# EasyEDA Pro project ProPrj_ant_switch_2026-03-30.epro

# Schematic Schematic1
Assembly Variant: Basic; Board Name: Board1; Create Date: 2026-03-23; Page Name: P1; Project Name: ant_switch; Schematic Name: Schematic1; Update Date: 2026-03-23; BladeWidth: 10; Company: 嘉立创EDA; Page Size: A4; RegionStart: 1; ShowBorder: 1; TitleBlock: 0; TitleBlockPosition: 3; Version: V1.0; XRegionCount: 6; YRegionCount: 4
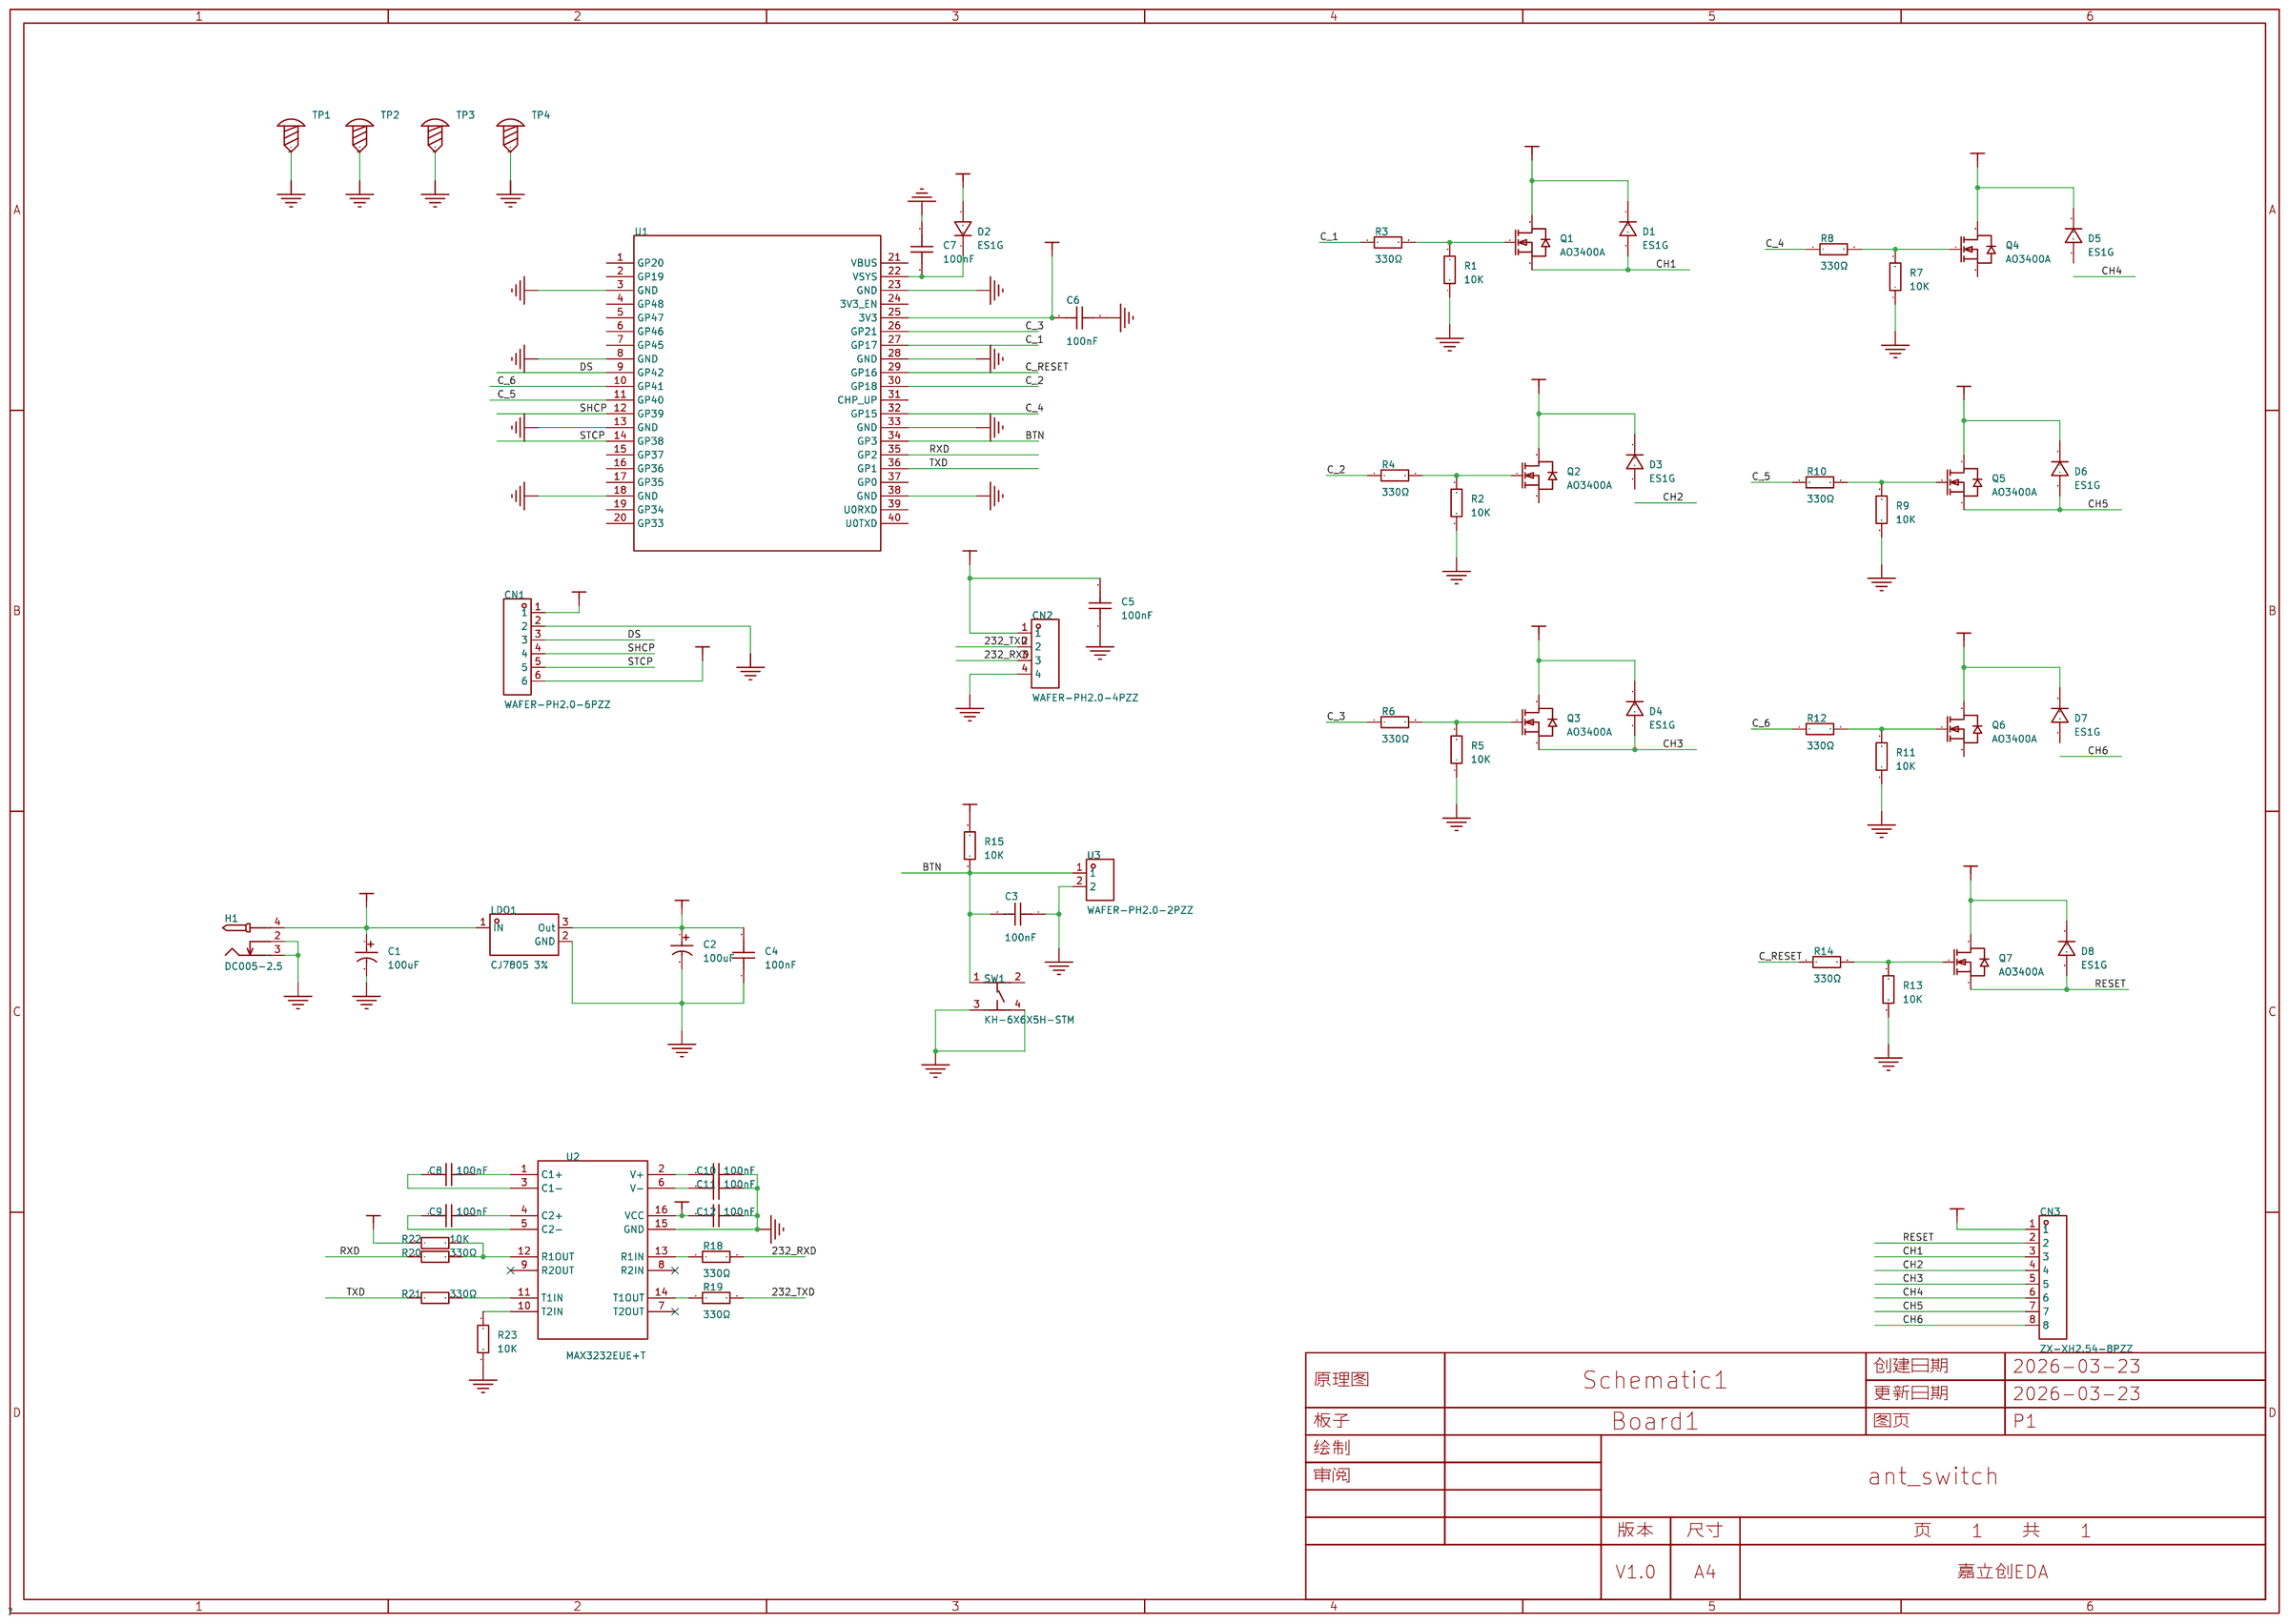
[diagram p0: schematic sheet]

## Parts
C1  100uF  [CAP-TH_BD6.3-P2.50-D1.0-FD]
C2  100uF  [CAP-TH_BD6.3-P2.50-D1.0-FD]
C3  100nF  [C0603]
C4  100nF  [C0603]
C5  100nF  [C0603]
C6  100nF  [C0603]
C7  100nF  [C0603]
C8  100nF  [C0603]
C9  100nF  [C0603]
C10  100nF  [C0603]
C11  100nF  [C0603]
C12  100nF  [C0603]
CN1  WAFER-PH2.0-6PZZ  [CONN-TH_6P-P2.00_PH2.0-6P]
CN2  WAFER-PH2.0-4PZZ  [CONN-TH_4P-P2.00_FWF20001-S04S22W5B]
CN3  ZX-XH2.54-8PZZ  [CONN-TH_8P-P2.50-XH2.54-8P]
D1  ES1G  [SMA_L4.4-W2.8-LS5.4-RD]
D2  ES1G  [SMA_L4.4-W2.8-LS5.4-RD]
D3  ES1G  [SMA_L4.4-W2.8-LS5.4-RD]
D4  ES1G  [SMA_L4.4-W2.8-LS5.4-RD]
D5  ES1G  [SMA_L4.4-W2.8-LS5.4-RD]
D6  ES1G  [SMA_L4.4-W2.8-LS5.4-RD]
D7  ES1G  [SMA_L4.4-W2.8-LS5.4-RD]
D8  ES1G  [SMA_L4.4-W2.8-LS5.4-RD]
H1  DC005-2.5  [DC-IN-TH_DC005-2.5MM]
LDO1  CJ7805 3%  [TO-252-2_L6.6-W6.1-P4.58-LS10.1-BR-CW]
Q1  AO3400A  [SOT-23-3_L2.9-W1.3-P1.90-LS2.4-BR]
Q2  AO3400A  [SOT-23-3_L2.9-W1.3-P1.90-LS2.4-BR]
Q3  AO3400A  [SOT-23-3_L2.9-W1.3-P1.90-LS2.4-BR]
Q4  AO3400A  [SOT-23-3_L2.9-W1.3-P1.90-LS2.4-BR]
Q5  AO3400A  [SOT-23-3_L2.9-W1.3-P1.90-LS2.4-BR]
Q6  AO3400A  [SOT-23-3_L2.9-W1.3-P1.90-LS2.4-BR]
Q7  AO3400A  [SOT-23-3_L2.9-W1.3-P1.90-LS2.4-BR]
R1  10K  [R0603]
R2  10K  [R0603]
R3  330Ω  [R0603]
R4  330Ω  [R0603]
R5  10K  [R0603]
R6  330Ω  [R0603]
R7  10K  [R0603]
R8  330Ω  [R0603]
R9  10K  [R0603]
R10  330Ω  [R0603]
R11  10K  [R0603]
R12  330Ω  [R0603]
R13  10K  [R0603]
R14  330Ω  [R0603]
R15  10K  [R0603]
R18  330Ω  [R0603]
R19  330Ω  [R0603]
R20  330Ω  [R0603]
R21  330Ω  [R0603]
R22  10K  [R0603]
R23  10K  [R0603]
SW1  KH-6X6X5H-STM  [SW-SMD_4P-L6.0-W6.0-P4.50-LS9.0_H5.0]
TP1  -  [M3螺丝孔]
TP2  -  [M3螺丝孔]
TP3  -  [M3螺丝孔]
TP4  -  [M3螺丝孔]
U1  -  [esp32-s3]
U2  MAX3232EUE+T  [TSSOP-16_L5.0-W4.4-P0.65-LS6.4-BL]
U3  WAFER-PH2.0-2PZZ  [CONN-TH_2P-P2.00_HC-PH-2A-M]

## Library data of the parts
C1 C2 = ERS1EM101E11OT: 容值:100uF;精度:±20%;额定电压:25V;; LCSC Part Name: 100uF ±20% 25V; Supplier Part: C112509; Manufacturer: AISHI(艾华集团); Supplier Footprint: 插件,D6.3xL11mm; JLCPCB Part Class: Extended Part; Datasheet: https://item.szlcsc.com/datasheet/ERS1EM101E11OT/113742.html; Supplier: LCSC; Tolerance: ±20%; Voltage Rating: 25V; Pin Spacing: 2.5mm; Diameter: 6.3mm; Height - Seated (Max): 11mm; Lifetime: 5000hrs@105℃
C3-C12 = CC0603KRX7R9BB104: 容值:100nF;精度:±10%;额定电压:50V;温度系数:X7R;; LCSC Part Name: 100nF ±10% 50V; Supplier Part: C14663; Manufacturer: YAGEO(国巨); Supplier Footprint: 0603; JLCPCB Part Class: Basic Part; Datasheet: https://item.szlcsc.com/datasheet/CC0603KRX7R9BB104/15331.html; Supplier: LCSC; Tolerance: ±10%; Voltage Rating: 50V; Temperature Coefficient: X7R
CN1 = WAFER-PH2.0-6PZZ: 插针结构:1x6P;间距:2mm;安装方式:直插;参考系列:PH;总PIN数:6P;排数:1;每排PIN数:6;行距:-;额定电流:2A;触头材质:黄铜;触头镀层:锡;工作温度:-25℃~+85℃;; LCSC Part Name: 1x6P 间距:2mm 直插 系列:PH; Supplier Part: C5359603; Manufacturer: XUNPU(讯普); Supplier Footprint: 插件,P=2mm; JLCPCB Part Class: Extended Part; Datasheet: https://atta.szlcsc.com/upload/public/pdf/source/20241108/09B74E94153224768C62B7F095CB8C18.pdf; Supplier: LCSC; Pins Structure: 1x6P; Pitch: 2mm; Mounting Type: 直插; Reference Series: PH; Number of Pins: 6P; Number of Rows: 1; Number of PINs Per Row: 6; Current Rating: 2A; Contact Material: 黄铜; Contact Plating: 锡; Operating Temperature: -25℃~+85℃; Voltage Rating: 250V; Plastic Material: PA66; Flame Retardant Rating: UL94V-0; Color: 白色; Z-Height of the Board: 6.05mm; X-Length of Bottom Edge on Board (Spacing Line): 14mm; Y-Width of Bottom Edge on Board: 4.7mm
CN2 = WAFER-PH2.0-4PZZ: 插针结构:1x4P;间距:2mm;安装方式:直插;参考系列:PH;总PIN数:4P;排数:1;每排PIN数:4;行距:-;额定电流:2A;触头材质:黄铜;触头镀层:锡;工作温度:-25℃~+85℃;; LCSC Part Name: 1x4P 间距:2mm 直插 系列:PH; Supplier Part: C5359601; Manufacturer: XUNPU(讯普); Supplier Footprint: 插件,P=2mm; JLCPCB Part Class: Extended Part; Datasheet: https://item.szlcsc.com/datasheet/WAFER-PH2.0-4PZZ/6173837.html; Supplier: LCSC; Pins Structure: 1x4P; Pitch: 2mm; Mounting Type: 直插; Reference Series: PH; Number of Pins: 4P; Number of Rows: 1; Number of PINs Per Row: 4; Current Rating: 2A; Contact Material: 黄铜; Contact Plating: 锡; Operating Temperature: -25℃~+85℃; Voltage Rating: 250V; Plastic Material: PA66; Flame Retardant Rating: UL94V-0; Color: 白色; Z-Height of the Board: 6.05mm; X-Length of Bottom Edge on Board (Spacing Line): 10mm; Y-Width of Bottom Edge on Board: 4.7mm
CN3 = ZX-XH2.54-8PZZ: 插针结构:1x8P;间距:2.5mm;安装方式:直插;参考系列:XH;总PIN数:8P;排数:1;每排PIN数:8;行距:-;额定电流:3A;触头材质:黄铜;触头镀层:锡;工作温度:-25℃~+85℃;; LCSC Part Name: 1x8P 间距:2.5mm 直插 系列:XH; Supplier Part: C7429638; Manufacturer: Megastar(兆星); Supplier Footprint: 插件,P=2.5mm; JLCPCB Part Class: Extended Part; Datasheet: https://item.szlcsc.com/datasheet/ZX-XH2.54-8PZZ/8427555.html; Supplier: LCSC; Pins Structure: 1x8P; Pitch: 2.5mm; Mounting Type: 直插; Reference Series: XH; Number of Pins: 8P; Number of Rows: 1; Number of PINs Per Row: 8; Current Rating: 3A; Contact Material: 黄铜; Contact Plating: 锡; Operating Temperature: -25℃~+85℃; Voltage Rating: 250V; Plastic Material: PA66; Flame Retardant Rating: UL94V-0; Color: 白色; Z-Height of the Board: 7mm; X-Length of Bottom Edge on Board (Spacing Line): 22.5mm; Y-Width of Bottom Edge on Board: 5.9mm
D1-D8 = ES1G_C124478: 二极管配置:-;正向压降(Vf):1.3V@1A;直流反向耐压(Vr):400V;整流电流:1A;反向恢复时间(Trr):35ns;; LCSC Part Name: 耐压:400V 电流:1A 反向恢复时间：35ns; Supplier Part: C124478; Manufacturer: onsemi(安森美); Supplier Footprint: SMA(DO-214AC); JLCPCB Part Class: Extended Part; Datasheet: https://item.szlcsc.com/datasheet/ES1G/125753.html; Supplier: LCSC; Voltage - Forward(Vf@If): 1.3V@1A; Voltage - DC Reverse(Vr): 400V; Current - Rectified: 1A; Reverse Leakage Current (Ir): 5uA@400V; Reverse Recovery Time (trr): 35ns; Pd - Power Dissipation: 1.47W; Non-Repetitive Peak Forward Surge Current: 30A
H1 = DC005-2.5: 连接器类型:DC电源插座;安装方式:弯插;触点内径:2.5mm;触点外径:6.3mm;额定电流:500mA;额定电压:12V;工作温度:-30℃~+70℃;; LCSC Part Name: DC005-2.5黑(铁); Supplier Part: C7507454; Manufacturer: SHOU HAN(首韩); Supplier Footprint: 插件; JLCPCB Part Class: Extended Part; Datasheet: https://item.szlcsc.com/datasheet/DC005-2.5/8598476.html; Supplier: LCSC; Connector Type: DC电源插座; Mounting Type: 弯插; Inside Contact Diameter: 2.5mm; Outside Contact Diameter: 6.3mm; Current Rating: 500mA; Voltage Rating (Max): 12V; Operating Temperature: -30℃~+70℃
LDO1 = CJ7805 3%: 输出类型:固定;工作电压:35V;输出电压:5V;输出电流:1.5A;电源纹波抑制比(PSRR):73dB@(120Hz);输出极性:正极;; LCSC Part Name: 5V 1.5A 35V; Supplier Part: C21706; Manufacturer: CJ(江苏长电/长晶); Supplier Footprint: TO-252-2(DPAK); JLCPCB Part Class: Extended Part; Datasheet: https://item.szlcsc.com/datasheet/CJ7805%25203%2525/22427.html; Supplier: LCSC; Output Type: 固定; Voltage - Supply: 35V; Output Voltage: 5V; Output Current: 1.5A; Power Supply Rejection Ratio (PSRR): 73dB@(120Hz); Voltage Dropout: 2V@(1A); standby current: 5mA; Operating Temperature: -25℃~+125℃@(Tj); Output Configuration: 正极; Number of Outputs: 1
Q1-Q7 = AO3400A_C347475: 数量:1个N沟道;漏源电压(Vdss):30V;连续漏极电流(Id):5.8A;导通电阻(RDS(on)):17mΩ@10V;耗散功率(Pd):1.4W;阈值电压(Vgs(th)):1.1V@250uA;; LCSC Part Name: 1个N沟道 耐压:30V 电流:5.8A; Supplier Part: C347475; Manufacturer: UMW(友台半导体); Supplier Footprint: SOT-23; JLCPCB Part Class: Extended Part; Datasheet: https://item.szlcsc.com/datasheet/AO3400A/324135.html; Supplier: LCSC; Number: 1个N沟道; Drain to Source Voltage: 30V; Current - Continuous Drain(Id): 5.8A; RDS(on): 17mΩ@10V; Pd - Power Dissipation: 1.4W; Gate Threshold Voltage (Vgs(th)): 1.1V@250uA; Gate Charge(Qg): 9.7nC@4.5V; Input Capacitance(Ciss): 823pF; Reverse Transfer Capacitance (Crss@Vds): 77pF; Operating Temperature: -55℃~+150℃; Output Capacitance(Coss): 99pF
R1 R2 R5 R7 R9 R11 R13 R15 R22 R23 = Res_0603: Supplier Footprint: 0603
R3 R4 R6 R8 R10 R12 R14 R18-R21 = 0603WAF3300T5E: 电阻类型:厚膜电阻;阻值:330Ω;精度:±1%;功率:100mW;最大工作电压:75V;温度系数:±100ppm/℃;; LCSC Part Name: 330Ω ±1% 100mW 厚膜电阻; Supplier Part: C23138; Manufacturer: UNI-ROYAL(厚声); Supplier Footprint: 0603; JLCPCB Part Class: Basic Part; Datasheet: https://atta.szlcsc.com/upload/public/pdf/source/20200306/C422600_1E6D84923E4A46A82E41ADD87F860B5C.pdf; Supplier: LCSC; Type: 厚膜电阻; Tolerance: ±1%; Power(Watts): 100mW; Overload Voltage (Max): 75V; Temperature Coefficient: ±100ppm/℃; Operating Temperature Range: -55℃~+155℃
SW1 = KH-6X6X5H-STM: 电路结构:单刀单掷;按钮形状:圆形按钮;安装方式:立贴;开关长度:6mm;开关宽度:6mm;开关高度:5mm;带支架:不带支架;触点电流:50mA;额定电压:12V;工作寿命:8万次;; LCSC Part Name: 6*6*5mm 立贴 轻触开关; Supplier Part: C2837531; Manufacturer: kinghelm(金航标); Supplier Footprint: SMD-4P,6x6mm; JLCPCB Part Class: Extended Part; Datasheet: https://item.szlcsc.com/datasheet/KH-6X6X5H-STM/3009601.html; Supplier: LCSC; Circuit: 单刀单掷; Actuator Style: 圆形按钮; Mounting Type: 立贴; Length: 6mm; Width: 6mm; Switch Height: 5mm; with Bracket: 不带支架; Contact Current: 50mA; Voltage Rating: 12V; Actuator/Cap Color: 黑色; Termination Style: 鸥翼型; Life: 8万次
TP1-TP4 = M3螺丝孔: Supplier Footprint: 插件
U1 = esp32-s3-eth-main: esp32eth coreboard
U2 = MAX3232EUE+T: 类型:收发器;数据速率:250Kbps;; LCSC Part Name: 3.0V至5.5V低功耗高达1Mbps真RS-232收发器使用四个0.1uF外部电容; Supplier Part: C19767; Manufacturer: ADI(亚德诺)/MAXIM(美信); Supplier Footprint: TSSOP-16; JLCPCB Part Class: Extended Part; Datasheet: https://item.szlcsc.com/datasheet/MAX3232EUE%252BT/20476.html; Supplier: LCSC; Type: 收发器; Number of Drivers: 2; Number of Receivers: 2; Data Rate: 250Kbps; Voltage - Supply: 3V~5.5V; ESD Protect: ±15kV; charge pump: 有; Operating Temperature: -40℃~+85℃; Supply Current (Iq): 1mA
U3 = WAFER-PH2.0-2PZZ: 插针结构:1x2P;间距:2mm;安装方式:直插;参考系列:PH;总PIN数:2P;排数:1;每排PIN数:2;行距:-;额定电流:2A;触头材质:黄铜;触头镀层:锡;工作温度:-25℃~+85℃;; LCSC Part Name: 1x2P 间距:2mm 直插 系列:PH; Supplier Part: C5359599; Manufacturer: XUNPU(讯普); Supplier Footprint: 插件,P=2mm; JLCPCB Part Class: Extended Part; Datasheet: https://atta.szlcsc.com/upload/public/pdf/source/20241108/09B74E94153224768C62B7F095CB8C18.pdf; Supplier: LCSC; Pins Structure: 1x2P; Pitch: 2mm; Mounting Type: 直插; Reference Series: PH; Number of Pins: 2P; Number of Rows: 1; Number of PINs Per Row: 2; Current Rating: 2A; Contact Material: 黄铜; Contact Plating: 锡; Operating Temperature: -25℃~+85℃; Voltage Rating: 250V; Plastic Material: PA66; Flame Retardant Rating: UL94V-0; Color: 白色; Z-Height of the Board: 6.05mm; X-Length of Bottom Edge on Board (Spacing Line): 6mm; Y-Width of Bottom Edge on Board: 4.7mm

## Nets
3V3: C6.2 R15.2 U1.25(3V3)
12VDC: C1.1 CN1.1 CN3.1 D1.1 D3.1 D4.1 D5.1 D6.1 D7.1 D8.1 H1.4 LDO1.1(IN) Q1.3(D) Q2.3(D) Q3.3(D) Q4.3(D) Q5.3(D) Q6.3(D) Q7.3(D)
+5V: C2.1 C4.2 C5.2 C12.2 CN1.6 CN2.1 D2.2 LDO1.3(Out) R22.2 U2.16(VCC)
GND: C1.2 C2.2 C3.1 C4.1 C5.1 C6.1 C7.1 C10.1 C11.1 C12.1 CN1.2 CN2.4 H1.2 H1.3 LDO1.2(GND) R1.1 R2.1 R5.1 R7.1 R9.1 R11.1 R13.1 R23.1 SW1.3 SW1.4 TP1.1 TP2.1 TP3.1 TP4.1 U1.3(GND) U1.8(GND) U1.13(GND) U1.18(GND) U1.23(GND) U1.28(GND) U1.33(GND) U1.38(GND) U2.15(GND) U3.2
232_RXD: CN2.3 R18.2
232_TXD: CN2.2 R19.2
BTN: C3.2 R15.1 SW1.1 U1.34(GP3) U3.1
C_1: R3.1 U1.27(GP17)
C_2: R4.1 U1.30(GP18)
C_3: R6.1 U1.26(GP21)
C_4: R8.1 U1.32(GP15)
C_5: R10.1 U1.11(GP40)
C_6: R12.1 U1.10(GP41)
C_RESET: R14.1 U1.29(GP16)
CH1: CN3.3 D1.2 Q1.2(S)
CH2: CN3.4 D3.2 Q2.2(S)
CH3: CN3.5 D4.2 Q3.2(S)
CH4: CN3.6 D5.2 Q4.2(S)
CH5: CN3.7 D6.2 Q5.2(S)
CH6: CN3.8 D7.2 Q6.2(S)
DS: CN1.3 U1.9(GP42)
RESET: CN3.2 D8.2 Q7.2(S)
RXD: R20.1 U1.35(GP2)
SHCP: CN1.4 U1.12(GP39)
STCP: CN1.5 U1.14(GP38)
TXD: R21.1 U1.36(GP1)
$1N44: C7.2 D2.1 U1.22(VSYS)
$1N47: Q1.1(G) R1.2 R3.2
$1N54: Q2.1(G) R2.2 R4.2
$1N59: Q3.1(G) R5.2 R6.2
$1N79: Q4.1(G) R7.2 R8.2
$1N84: Q5.1(G) R9.2 R10.2
$1N89: Q6.1(G) R11.2 R12.2
$1N94: Q7.1(G) R13.2 R14.2
$1N131: C8.1 U2.1(C1+)
$1N132: C8.2 U2.3(C1-)
$1N133: C9.2 U2.5(C2-)
$1N134: C9.1 U2.4(C2+)
$1N135: C10.2 U2.2(V+)
$1N136: C11.2 U2.6(V-)
$1N142: R18.1 U2.13(R1IN)
$1N144: R19.1 U2.14(T1OUT)
$1N145: R20.2 R22.1 U2.12(R1OUT)
$1N147: R21.2 U2.11(T1IN)
$1N149: R23.2 U2.10(T2IN)

Not connected (* = marked no-connect by the designer): SW1 2; U1 1(GP20) 2(GP19) 4(GP48) 5(GP47) 6(GP46) 7(GP45) 15(GP37) 16(GP36) 17(GP35) 19(GP34) 20(GP33) 21(VBUS) 24(3V3_EN) 31(CHP_UP) 37(GP0) 39(U0RXD) 40(U0TXD); U2 7(T2OUT)* 8(R2IN)* 9(R2OUT)*

# Board PCB1
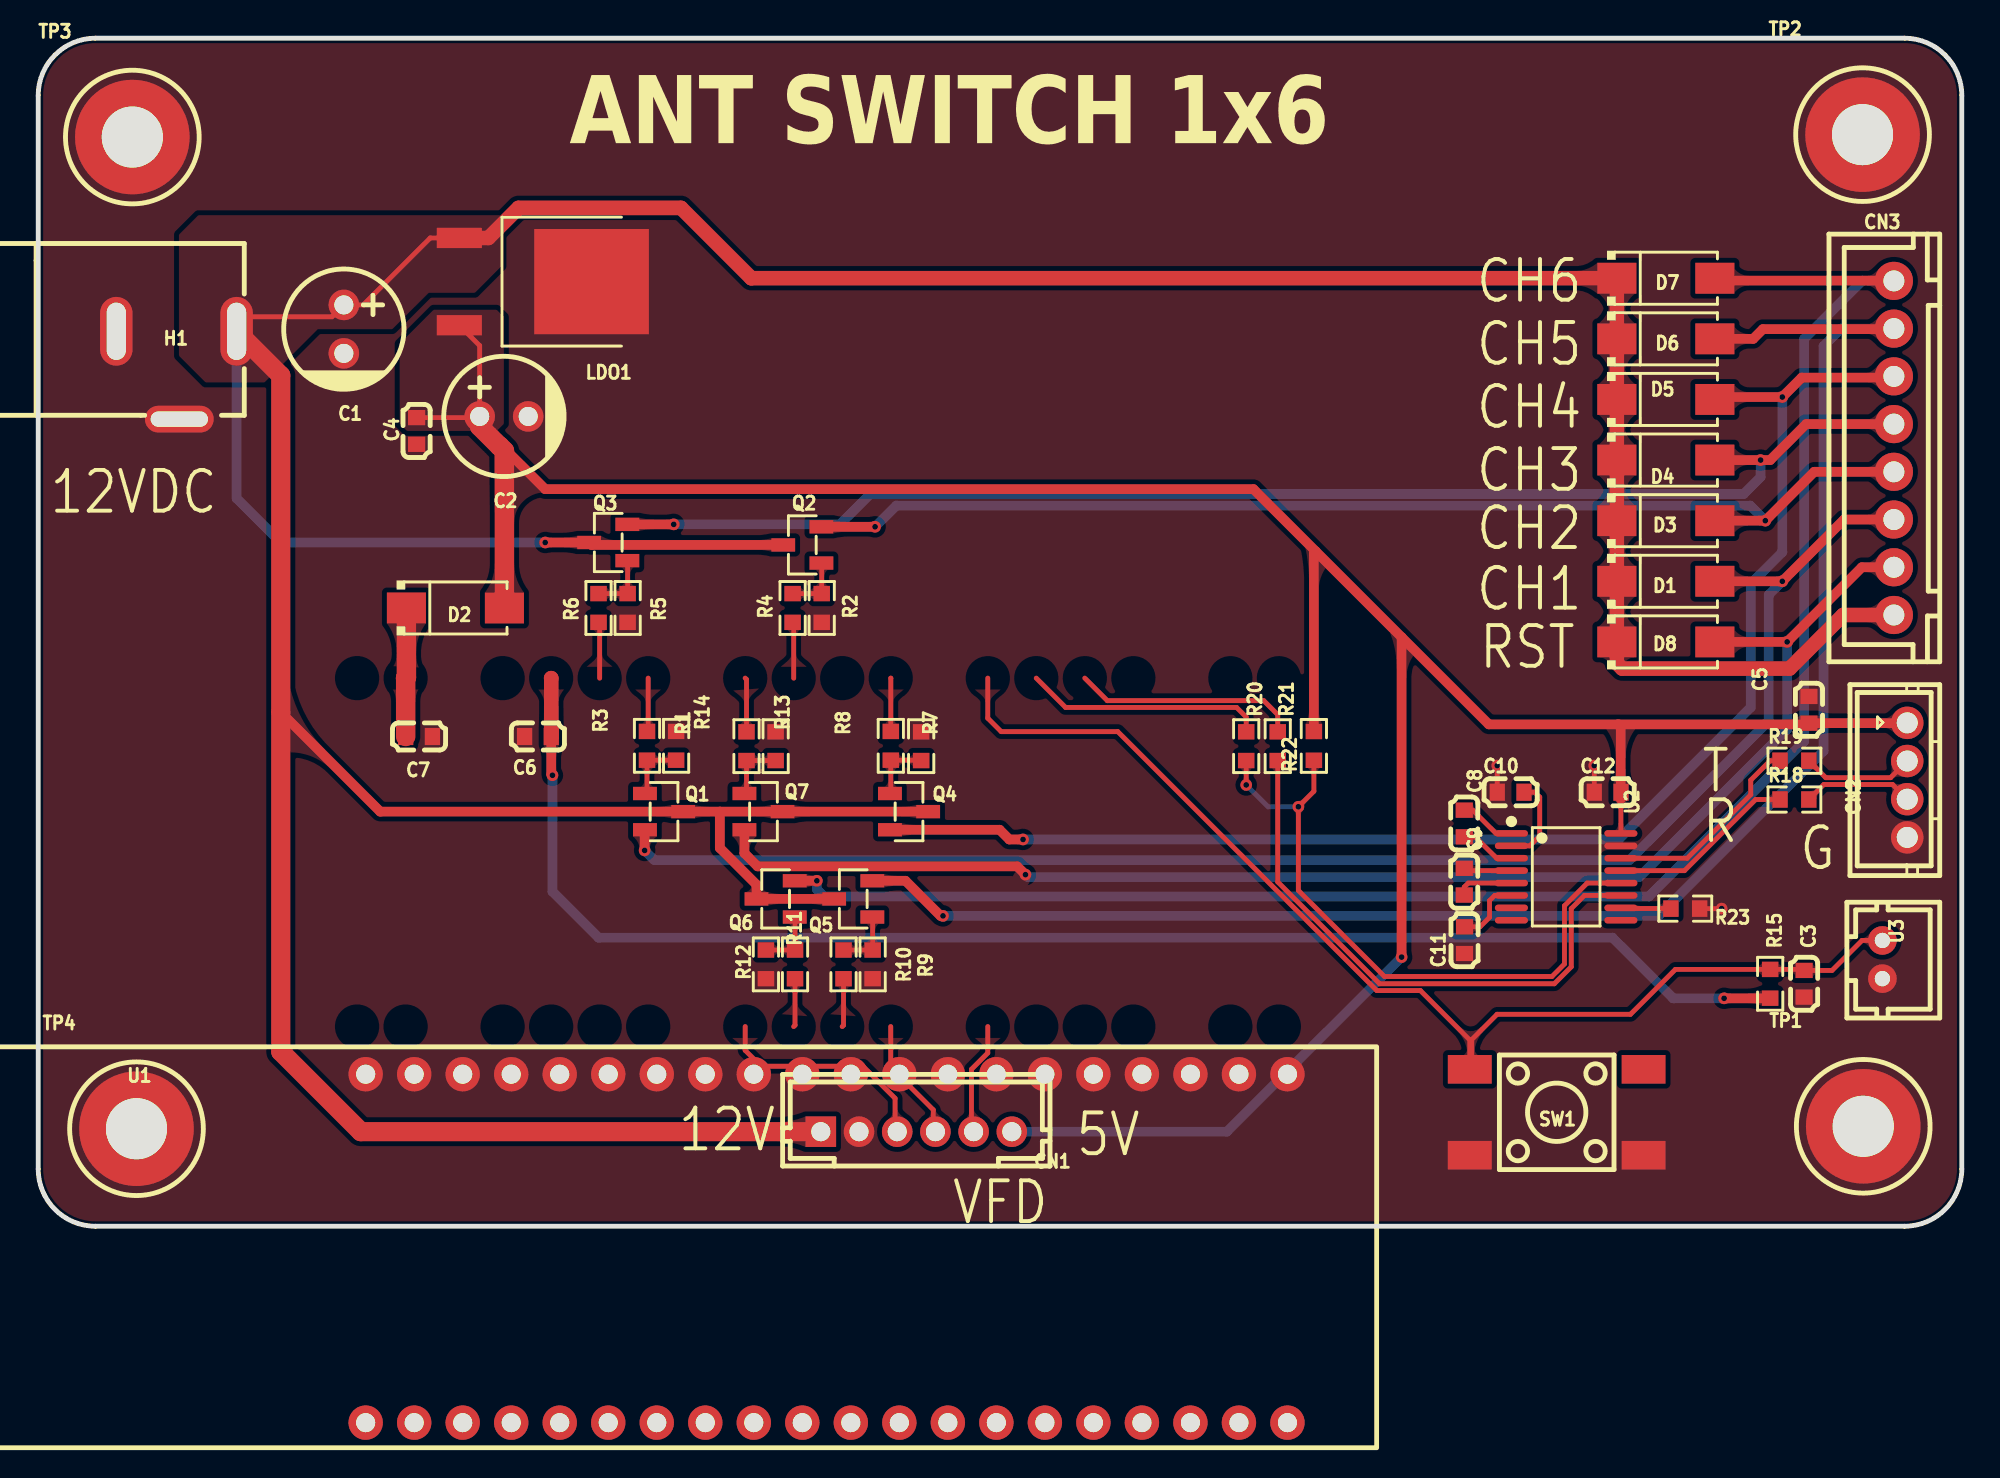
[diagram p1: board, top side]
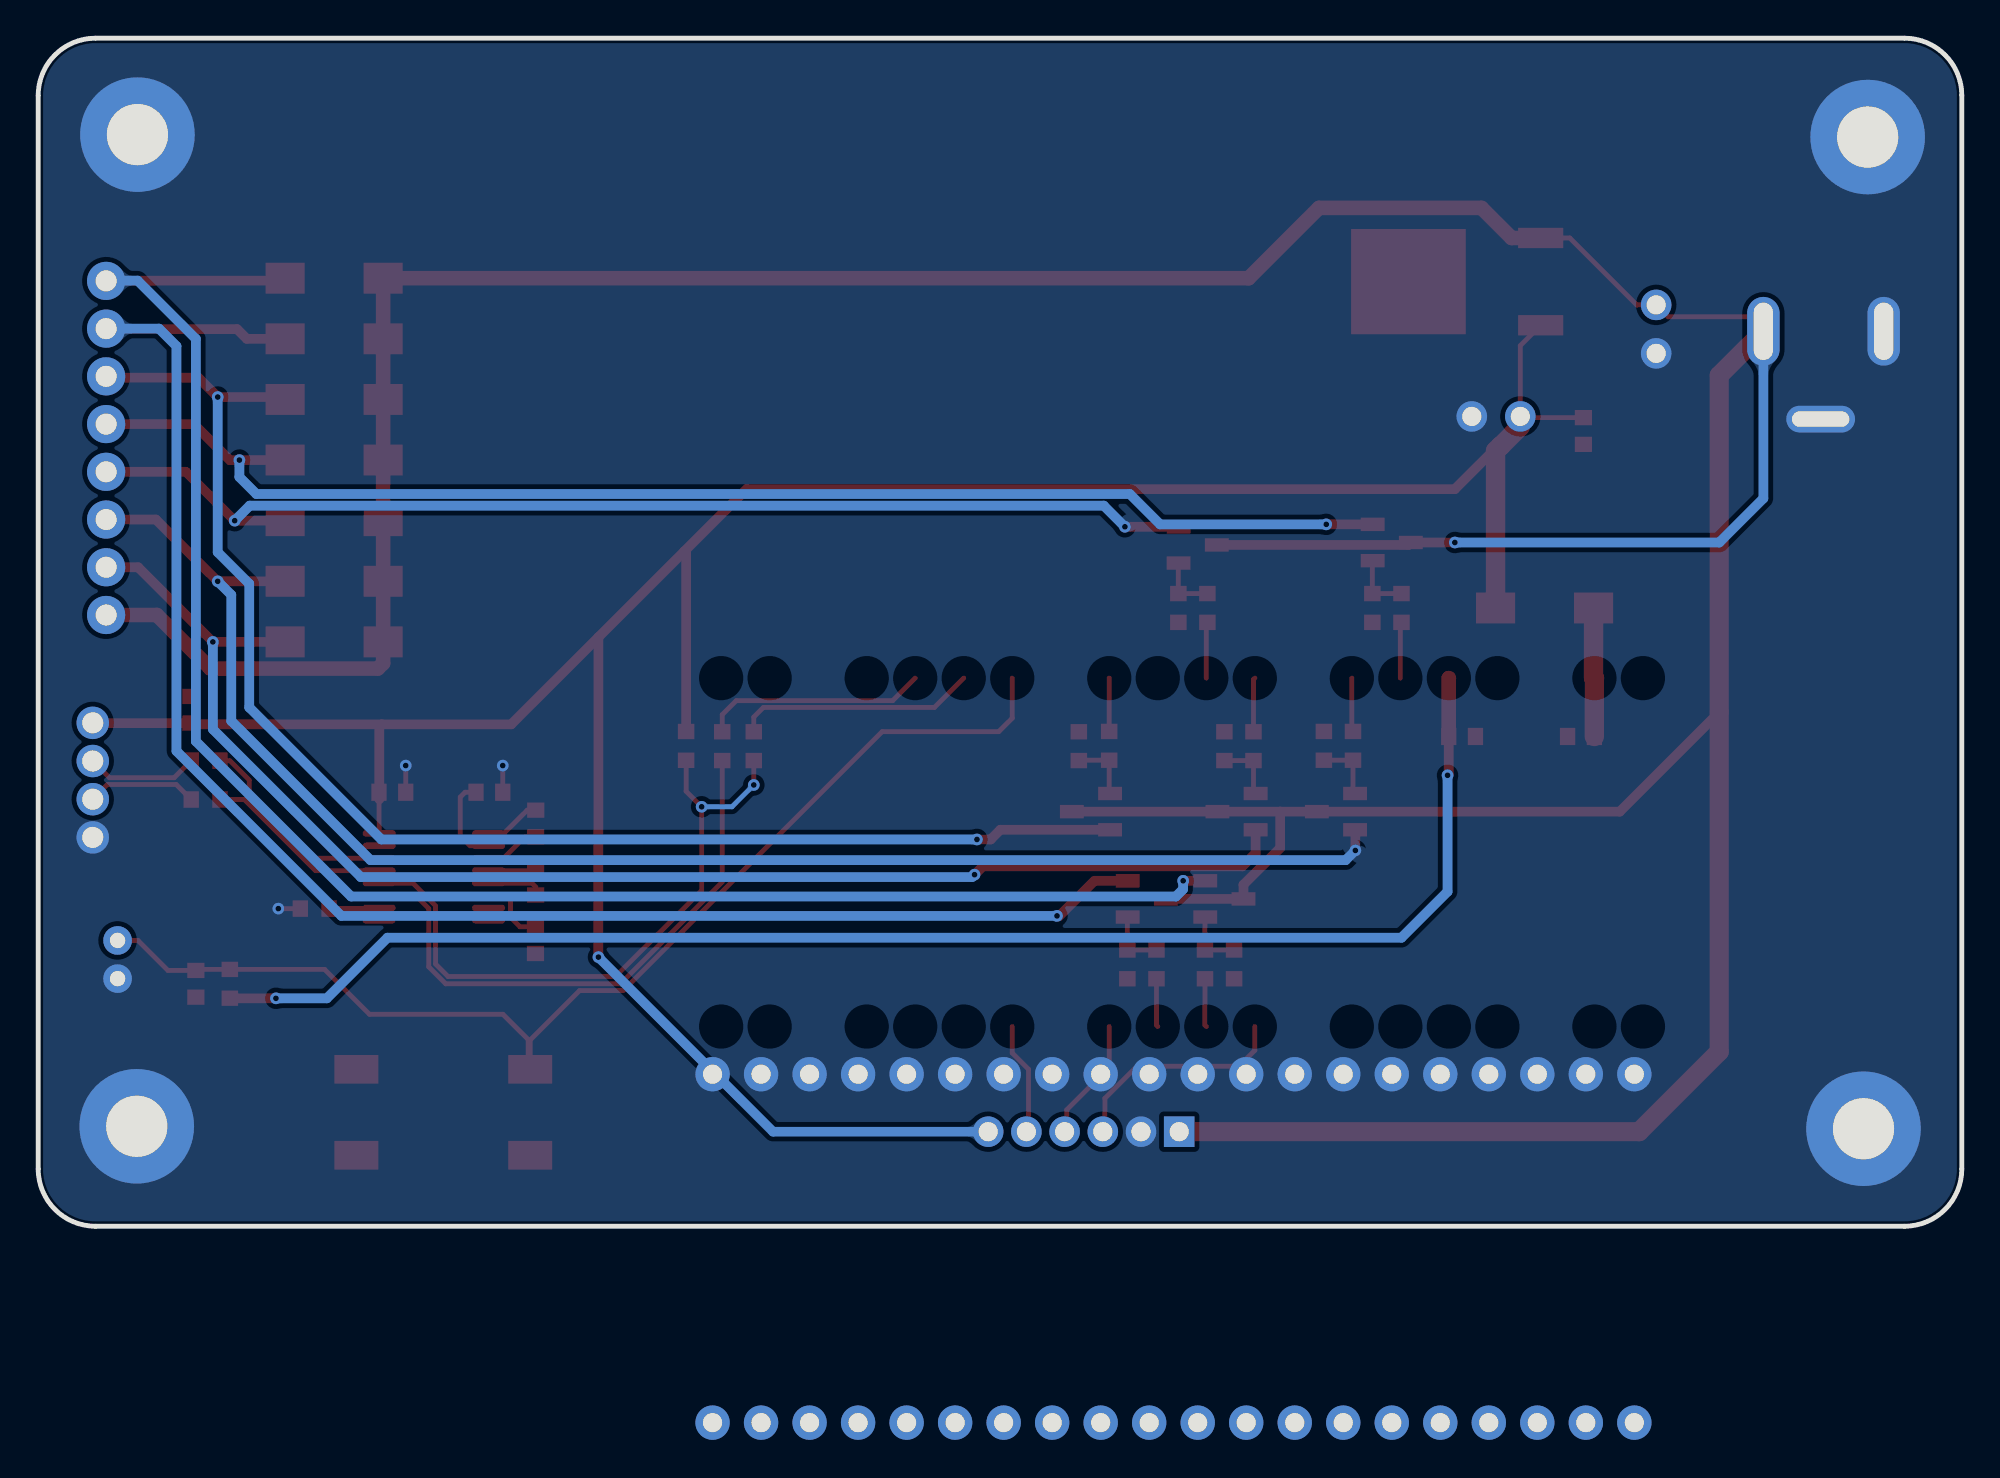
[diagram p2: board, bottom side, seen from below]

Outline 100.71 x 62.23 mm; copper layers: Top Layer, Bottom Layer. Coordinates in mm from the lower left corner of the outline.
Outline path: 0,59.23 0,3 arc(0.88,0.88) 3,0 97.71,0 arc(99.83,0.88) 100.71,3 100.71,59.23 arc(99.83,61.35) 97.71,62.23 3,62.23 arc(0.88,61.35) 0,59.23
Stack: Top Layer 0.035mm / Dielectric1 1.51mm FR4 er 4.5 / Bottom Layer 0.035mm

## Design rules (mm)
spacing copperThickness1oz (default): track to track 0.102, other pairs 0.152 to 0.3
spacing copperThickness2oz: track to track 0.203, other pairs 0.152 to 0.3
track width copperThickness1oz (default): min 0.127, default 0.254, max 2.54
track width copperThickness2oz: min 0.203, default 0.254, max 2.54
differential pair differentialPair (default): width min 0.127, default 0.254, max 2.54; gap min 0.152, default 0.152
net 12VDC uses copperRegion_copperThickness1oz
net +5V uses copperRegion_copperThickness1oz
pour e202 uses copperRegion_default, default
net GND uses copperRegion_copperThickness1oz
pour e200 uses copperRegion_copperThickness1oz, copperThickness1oz

## Placement (name value [footprint] x y rotation side)
C1  100uF  [CAP-TH_BD6.3-P2.50-D1.0-FD]  16 46.99 270 top
C2  100uF  [CAP-TH_BD6.3-P2.50-D1.0-FD]  24.38 42.42 0 top
C3  100nF  [C0603]  92.46 12.7 90 top
C4  100nF  [C0603]  19.81 41.66 90 top
C5  100nF  [C0603]  92.71 27.05 270 top
C6  100nF  [C0603]  26.16 25.65 0 top
C7  100nF  [C0603]  19.94 25.65 180 top
C8  100nF  [C0603]  74.66 21.1 270 top
C9  100nF  [C0603]  74.66 18.05 270 top
C10  100nF  [C0603]  77.09 22.73 0 top
C11  100nF  [C0603]  74.68 14.99 90 top
C12  100nF  [C0603]  82.17 22.73 0 top
CN1  WAFER-PH2.0-6PZZ  [CONN-TH_6P-P2.00_PH2.0-6P]  45.97 4.95 180 top
CN2  WAFER-PH2.0-4PZZ  [CONN-TH_4P-P2.00_FWF20001-S04S22W5B]  97.85 23.37 270 top
CN3  ZX-XH2.54-8PZZ  [CONN-TH_8P-P2.50-XH2.54-8P]  97.16 40.77 270 top
D1  ES1G  [SMA_L4.4-W2.8-LS5.4-RD]  85.22 33.78 0 top
D2  ES1G  [SMA_L4.4-W2.8-LS5.4-RD]  21.84 32.39 0 top
D3  ES1G  [SMA_L4.4-W2.8-LS5.4-RD]  85.22 36.96 0 top
D4  ES1G  [SMA_L4.4-W2.8-LS5.4-RD]  85.22 40.13 0 top
D5  ES1G  [SMA_L4.4-W2.8-LS5.4-RD]  85.22 43.31 0 top
D6  ES1G  [SMA_L4.4-W2.8-LS5.4-RD]  85.22 46.48 0 top
D7  ES1G  [SMA_L4.4-W2.8-LS5.4-RD]  85.22 49.66 0 top
D8  ES1G  [SMA_L4.4-W2.8-LS5.4-RD]  85.22 30.61 0 top
H1  DC005-2.5  [DC-IN-TH_DC005-2.5MM]  7.24 44.58 0 top
LDO1  CJ7805 3%  [TO-252-2_L6.6-W6.1-P4.58-LS10.1-BR-CW]  25.51 49.48 180 top
Q1  AO3400A  [SOT-23-3_L2.9-W1.3-P1.90-LS2.4-BR]  32.77 21.72 180 top
Q2  AO3400A  [SOT-23-3_L2.9-W1.3-P1.90-LS2.4-BR]  40 35.69 0 top
Q3  AO3400A  [SOT-23-3_L2.9-W1.3-P1.90-LS2.4-BR]  29.84 35.81 0 top
Q4  AO3400A  [SOT-23-3_L2.9-W1.3-P1.90-LS2.4-BR]  45.59 21.72 180 top
Q5  AO3400A  [SOT-23-3_L2.9-W1.3-P1.90-LS2.4-BR]  42.67 17.15 0 top
Q6  AO3400A  [SOT-23-3_L2.9-W1.3-P1.90-LS2.4-BR]  38.61 17.15 0 top
Q7  AO3400A  [SOT-23-3_L2.9-W1.3-P1.90-LS2.4-BR]  37.97 21.72 180 top
R1  10K  [R0603]  33.4 25.17 270 top
R2  10K  [R0603]  41.02 32.39 90 top
R3  330Ω  [R0603]  31.87 25.17 270 top
R4  330Ω  [R0603]  39.5 32.39 90 top
R5  10K  [R0603]  30.86 32.39 90 top
R6  330Ω  [R0603]  29.34 32.39 90 top
R7  10K  [R0603]  46.23 25.15 270 top
R8  330Ω  [R0603]  44.64 25.17 270 top
R9  10K  [R0603]  43.69 13.72 90 top
R10  330Ω  [R0603]  42.16 13.72 90 top
R11  10K  [R0603]  38.1 13.72 90 top
R12  330Ω  [R0603]  39.62 13.72 90 top
R13  10K  [R0603]  38.61 25.15 270 top
R14  330Ω  [R0603]  37.08 25.15 270 top
R15  10K  [R0603]  90.68 12.7 270 top
R18  330Ω  [R0603]  91.95 22.35 0 top
R19  330Ω  [R0603]  91.95 24.38 0 top
R20  330Ω  [R0603]  63.25 25.15 270 top
R21  330Ω  [R0603]  64.9 25.15 270 top
R22  10K  [R0603]  66.79 25.16 90 top
R23  10K  [R0603]  86.23 16.64 180 top
SW1  KH-6X6X5H-STM  [SW-SMD_4P-L6.0-W6.0-P4.50-LS9.0_H5.0]  79.5 5.97 0 top
TP1  -  [M3螺丝孔]  95.55 5.24 0 top
TP2  -  [M3螺丝孔]  95.51 57.18 0 top
TP3  -  [M3螺丝孔]  4.93 57.05 0 top
TP4  -  [M3螺丝孔]  5.15 5.11 0 top
U1  -  [esp32-s3]  -3.17 9.14 0 top
U2  MAX3232EUE+T  [TSSOP-16_L5.0-W4.4-P0.65-LS6.4-BL]  80 18.3 270 top
U3  WAFER-PH2.0-2PZZ  [CONN-TH_2P-P2.00_HC-PH-2A-M]  96.56 13.97 270 top

## Footprints (pads in the part's own frame, mm; a bottom-side part is the same pattern mirrored in y, then rotated)
C0603
  rect 0.8x0.9 smd: 1(-0.7,0) 2(0.7,0)
CAP-TH_BD6.3-P2.50-D1.0-FD
  round 1.6 hole 1: 1(-1.27,0) 2(1.27,0)
CONN-TH_2P-P2.00_HC-PH-2A-M
  round 1.5 hole 0.8: 1(-1,0) 2(1,0)
CONN-TH_4P-P2.00_FWF20001-S04S22W5B
  round 1.7 hole 1.1: 1(-3,0) 2(-1,0) 3(1,0) 4(3,0)
CONN-TH_6P-P2.00_PH2.0-6P
  rect 1.6x1.6 hole 1: 1(5,0)
  round 1.6 hole 1: 2(3,0) 3(1,0) 4(-1,0) 5(-3,0) 6(-5,0)
CONN-TH_8P-P2.50-XH2.54-8P
  round 2 hole 1.1: 1(8.75,0) 2(6.25,0) 3(3.75,0) 4(1.25,0) 5(-1.25,0) 6(-3.75,0) 7(-6.25,0) 8(-8.75,0)
DC-IN-TH_DC005-2.5MM
  oval 3.6x1.4 hole 3x0.8: 2(0.15,-2.3)
  oval 1.7x3.6 hole 1x3: 3(-3.15,2.3) 4(3.15,2.3)
esp32-s3
  round 1.8 hole 1: 1(20.32,-19.431) 2(22.86,-19.431) 3(25.4,-19.431) 4(27.94,-19.431) 5(30.48,-19.431) 6(33.02,-19.431) 7(35.56,-19.431) 8(38.1,-19.431) 9(40.64,-19.431) 10(43.18,-19.431) 11(45.72,-19.431) 12(48.26,-19.431) 13(50.8,-19.431) 14(53.34,-19.431) 15(55.88,-19.431) 16(58.42,-19.431) 17(60.96,-19.431) 18(63.5,-19.431) 19(66.04,-19.431) 20(68.58,-19.431) 21(20.32,-1.181) 22(22.86,-1.181) 23(25.4,-1.181) 24(27.94,-1.181) 25(30.48,-1.181) 26(33.02,-1.181) 27(35.56,-1.181) 28(38.1,-1.181) 29(40.64,-1.181) 30(43.18,-1.181) 31(45.72,-1.181) 32(48.26,-1.181) 33(50.8,-1.181) 34(53.34,-1.181) 35(55.88,-1.181) 36(58.42,-1.181) 37(60.96,-1.181) 38(63.5,-1.181) 39(66.04,-1.181) 40(68.58,-1.181)
M3螺丝孔
  round 6 hole 3.2: 1(0,0)
R0603
  rect 0.806x0.864 smd: 1(-0.753,0) 2(0.753,0)
SMA_L4.4-W2.8-LS5.4-RD
  rect 2.046x1.62 smd: 1(-2.566,0) 2(2.566,0)
SOT-23-3_L2.9-W1.3-P1.90-LS2.4-BR
  rect 1.25x0.7 smd: 1(1,-0.95) 2(1,0.95) 3(-1,0)
SW-SMD_4P-L6.0-W6.0-P4.50-LS9.0_H5.0
  rect 2.3x1.5 smd: 1(-4.55,2.25) 2(4.55,2.25) 3(-4.55,-2.25) 4(4.55,-2.25)
TO-252-2_L6.6-W6.1-P4.58-LS10.1-BR-CW
  rect 2.364x1.064 smd: 1(3.462,-2.286) 3(3.462,2.286)
  rect 6.004x5.512 smd: 2(-3.462,0)
TSSOP-16_L5.0-W4.4-P0.65-LS6.4-BL
  oval 0.343x1.732 smd: 1(-2.275,-2.866) 2(-1.625,-2.866) 3(-0.975,-2.866) 4(-0.325,-2.866) 5(0.325,-2.866) 6(0.975,-2.866) 7(1.625,-2.866) 8(2.275,-2.866) 9(2.275,2.866) 10(1.625,2.866) 11(0.975,2.866) 12(0.325,2.866) 13(-0.325,2.866) 14(-0.975,2.866) 15(-1.625,2.866) 16(-2.275,2.866)

## Nets
As in the schematic.

Pads without a net: SW1 2; U1 1 2 4 5 6 7 15 16 17 19 20 21 24 31 37 39 40; U2 7 8 9

## Via types
v1: diameter 0.61, hole 0.305, Top Layer to Bottom Layer, 21 vias

## Routing (per net, layer and track width the routed paths; a pad name or vN(x,y) marks a point on that pad's centre or on a via; arc(x,y) is an arc through that point)
3V3: length 77.3
  Top Layer w0.508: R15.2 90.67,11.94 v1(88.26,11.94) ; v1(26.92,23.62) 26.86,23.68 C6.2
  Top Layer w0.762: 26.86,28.71 26.86,28.7 C6.2
  Bottom Layer w0.508: v1(26.92,23.62) 26.92,17.53 29.34,15.11 82.42,15.11 85.6,11.94 v1(88.26,11.94)
12VDC: length 266.1
  Top Layer w0.254: 10.39,47.64 15.38,47.64 16,48.26 17.02,48.26 20.52,51.76 LDO1.1
  Top Layer w0.508: 35.69,21.72 Q1.3 17.91,21.72 12.7,26.92 ; 35.69,21.72 35.69,19.81 37.61,17.89 Q6.3 Q5.3 ; 35.69,21.72 Q7.3 Q4.3 ; Q2.3 28.97,35.69 Q3.3 v1(26.54,35.81) ; 10.39,47.64 10.39,46.88
  Top Layer w0.762: CN3.1 94.5,32.02 91.69,29.21 82.93,29.21 82.65,29.49 D8.1 D1.1 D3.1 D4.1 D5.1 D6.1 D7.1 37.34,49.66 33.66,53.34 25.15,53.34 23.57,51.76 LDO1.1
  Top Layer w1: 40.85,4.95 16.89,4.95 12.7,9.14 12.7,44.57 10.39,46.88
  Bottom Layer w0.508: 10.39,47.64 10.39,38.13 12.7,35.81 v1(26.54,35.81)
+5V: length 154.6
  Top Layer w0.254: 82.85,22.37 82.86,22.36 U2.16 ; LDO1.3 23.11,46.13 C2.1 23.05,42.36 C4.2
  Top Layer w0.508: 71.38,30.85 v1(71.38,14.1) ; 71.38,30.85 66.89,35.35 ; 71.38,30.85 75.95,26.29 82.72,26.29 ; 24.41,40.61 24.54,40.61 26.54,38.61 63.63,38.61 66.89,35.35 ; 66.89,35.35 66.79,35.25 R22.2 ; 97.79,26.37 97.77,26.35 C5.2 ; 82.72,26.29 82.85,26.16 82.85,22.37 ; 82.72,26.29 92.65,26.29
  Top Layer w1.016: C2.1 23.11,41.89 24.15,40.86 24.16,40.87 24.41,40.61 D2.2
  Bottom Layer w0.5: CN1.6 62.24,4.95 v1(71.38,14.1)
GND: length 3.9
  Top Layer w0.254: R23.1 v1(88.14,16.64) ; 81.47,22.73 v1(81.47,24.13) ; C10.1 v1(76.39,24.13)
232_RXD: length 5.8
  Top Layer w0.254: CN2.3 97.08,23.14 93.49,23.14 R18.2
232_TXD: length 5.9
  Top Layer w0.254: CN2.2 96.98,23.5 93.59,23.5 R19.2
BTN: length 61.1
  Top Layer w0.254: 49.72,28.71 49.72,26.61 50.42,25.91 56.52,25.91 70.08,12.34 72.37,12.34 74.95,9.76 SW1.1 75.06,8.32 75.06,9.78 76.38,11.1 83.36,11.1 85.72,13.45 R15.1 92.4,13.45 C3.2 93.92,13.4 95.49,14.97 U3.1
C_1: length 2.8
  Top Layer w0.254: 31.94,28.71 31.94,25.98 R3.1
C_2: length 2.9
  Top Layer w0.254: 39.56,28.71 39.56,31.57 R4.1
C_3: length 2.9
  Top Layer w0.254: R6.1 29.4,31.57 29.4,28.71
C_4: length 2.8
  Top Layer w0.254: R8.1 44.64,28.7 44.63,28.71
C_5: length 2.5
  Top Layer w0.254: R10.1 42.16,10.53 42.09,10.46
C_6: length 2.5
  Top Layer w0.254: R12.1 39.62,10.53 39.56,10.46
C_RESET: length 2.8
  Top Layer w0.254: 37.01,28.71 37.08,28.64 R14.1
CH1: length 81.5
  Top Layer w0.508: D1.2 v1(91.31,33.78) 94.55,37.02 CN3.3 ; v1(31.75,19.69) 31.75,20.75 Q1.2
  Bottom Layer w0.508: v1(91.31,33.78) 90.6,33.07 90.6,26.47 83.31,19.18 32.26,19.18 v1(31.75,19.69)
CH2: length 60.6
  Top Layer w0.508: D3.2 v1(90.42,36.96) 92.98,39.52 CN3.4 ; Q2.2 v1(43.81,36.64)
  Bottom Layer w0.508: v1(43.81,36.64) 44.92,37.74 89.64,37.74 v1(90.42,36.96)
CH3: length 71.4
  Top Layer w0.508: D4.2 v1(90.18,40.13) 90.68,40.13 92.56,42.02 CN3.5 ; Q3.2 v1(33.27,36.76)
  Bottom Layer w0.508: v1(33.27,36.76) 41.97,36.76 43.56,38.35 89.29,38.35 90.18,39.24 v1(90.18,40.13)
CH4: length 75
  Top Layer w0.508: v1(51.56,20.26) 50.84,20.26 50.34,20.77 Q4.2 ; CN3.6 97.09,44.45 92.33,44.45 v1(91.31,43.43) 87.91,43.43 D5.2
  Bottom Layer w0.508: v1(91.31,43.43) 91.31,35.31 89.66,33.66 89.66,27.18 82.74,20.26 v1(51.56,20.26)
CH5: length 89
  Top Layer w0.508: CN3.7 97.13,46.99 90.3,46.99 89.79,46.48 D6.2 ; v1(47.37,16.26) 47.24,16.26 45.41,18.1 Q5.2
  Bottom Layer w0.508: CN3.7 94.39,47.02 93.47,46.1 93.47,24.89 84.84,16.26 v1(47.37,16.26)
CH6: length 93.6
  Top Layer w0.508: D7.2 87.91,49.53 97.17,49.53 ; 97.17,49.53 CN3.8 ; 97.17,49.53 97.28,49.53 ; Q6.2 v1(40.77,18.1)
  Bottom Layer w0.508: 97.28,49.53 95.5,49.53 92.46,46.48 92.46,25.4 84.33,17.27 41.15,17.27 40.77,17.65 v1(40.77,18.1)
DS: length 11.8
  Top Layer w0.254: 44.86,5.08 44.86,6.7 43.18,8.38 37.85,8.38 37.01,9.21 37.01,10.46
RESET: length 75.1
  Top Layer w0.508: CN3.2 95.48,34.52 v1(91.57,30.61) D8.2 ; Q7.2 36.97,19.54 37.66,18.85 51.25,18.85 v1(51.69,18.42)
  Bottom Layer w0.508: v1(51.69,18.42) 51.82,18.29 83.82,18.29 91.57,26.04 v1(91.57,30.61)
RXD: length 12.6
  Top Layer w0.254: R20.1 63.25,26.67 62.74,27.17 53.79,27.17 52.25,28.71
SHCP: length 6.3
  Top Layer w0.254: 46.86,5.08 46.86,6.1 44.63,8.32 44.63,10.46
STCP: length 5.7
  Top Layer w0.254: 49.72,10.46 49.72,9.08 48.86,8.22 48.86,5.08
TXD: length 11.8
  Top Layer w0.254: R21.1 64.9,26.8 64.16,27.53 55.97,27.53 54.79,28.71
$1N44: length 6.8
  Top Layer w1.016: D2.1 19.28,28.75 19.23,28.71 19.24,28.71 19.24,25.65
$1N47: length 3.3
  Top Layer w0.254: R1.2 R3.2 31.87,22.78 Q1.1
$1N54: length 3.1
  Top Layer w0.254: Q2.1 41.02,34.72 R2.2 R4.2
$1N59: length 3.3
  Top Layer w0.254: R6.2 R5.2 30.86,34.85 30.84,34.86
$1N79: length 3.4
  Top Layer w0.254: R7.2 46.21,24.41 R8.2 44.64,22.71 Q4.1
$1N84: length 3.3
  Top Layer w0.254: Q5.1 43.69,16.18 R9.2 R10.2
$1N89: length 3.3
  Top Layer w0.254: R11.2 R12.2 39.62,16.18 Q6.1
$1N94: length 3.3
  Top Layer w0.254: R13.2 R14.2 37.08,22.78 Q7.1
$1N131: length 3
  Top Layer w0.254: C8.1 75.11,21.8 76.32,20.58 77.13,20.58
$1N132: length 2.9
  Top Layer w0.254: 77.13,19.28 76.35,19.28 75.24,20.4 C8.2
$1N133: length 3
  Top Layer w0.254: 77.13,17.98 74.87,17.98 74.66,17.77 C9.2
$1N134: length 2.5
  Top Layer w0.254: C9.1 74.78,18.63 77.13,18.63
$1N135: length 4.7
  Top Layer w0.254: 77.13,19.93 78.09,19.93 78.61,20.45 78.61,22.48 78.36,22.73 C10.2
$1N136: length 3.6
  Top Layer w0.254: 74.68,15.69 75.49,15.69 75.99,16.18 75.99,17.06 76.25,17.33 77.13,17.33
$1N142: length 9.9
  Top Layer w0.254: U2.13 86.19,18.63 89.92,22.35 R18.1
$1N144: length 10.9
  Top Layer w0.254: R19.1 90.68,24.38 89.66,23.37 89.66,22.61 86.33,19.28 U2.14
$1N145: length 34.2
  Top Layer w0.254: U2.12 81.1,17.98 79.91,16.78 79.91,13.74 79.25,13.08 70.49,13.08 65.98,17.59 v1(65.98,21.97) 66.79,22.78 R22.1 ; v1(63.25,23.11) R20.2
  Bottom Layer w0.254: v1(65.98,21.97) 64.39,21.97 v1(63.25,23.11)
$1N147: length 30.2
  Top Layer w0.254: U2.11 80.95,17.33 80.26,16.64 80.26,13.59 79.38,12.7 70.23,12.7 64.9,18.03 R21.2
$1N149: length 2.6
  Top Layer w0.254: 85.46,16.64 82.9,16.64 U2.10

## Copper pours and planes (outline as drawn; the poured copper is in the pictures)
12VDC on Top Layer: 7.37,51.94 8.38,52.96 24.26,52.96 24.26,50.29 22.86,48.9 20.45,48.9 18.54,46.99 14.64,46.99 11.85,44.2 8.76,44.2 7.37,45.59
+5V on Top Layer: 20.7,48.01 24,48.01 24.38,47.63 24.38,42.04 24,41.66 19.3,41.66 18.92,42.04 18.92,46.23
GND on Top Layer: -11.68,68.58 110.87,68.58 110.87,-13.21 -11.68,-13.21
GND on Bottom Layer: -12.83,70.87 109.85,70.87 109.85,-12.19 -12.83,-12.19

Small or netless copper shapes (teardrops, artwork), in the pictures only: 193 on Top Layer, 21 on Bottom Layer

## Text on the board
Top Silkscreen Layer: 12VDC | 12V | VFD | 5V | CH6 | CH5 | CH4 | CH3 | CH2 | CH1 | RST | T | R | G | ANT SWITCH 1x6
